# EasyEDA Pro project STC-FOC-C2822.epro, board STC-FOC_V3
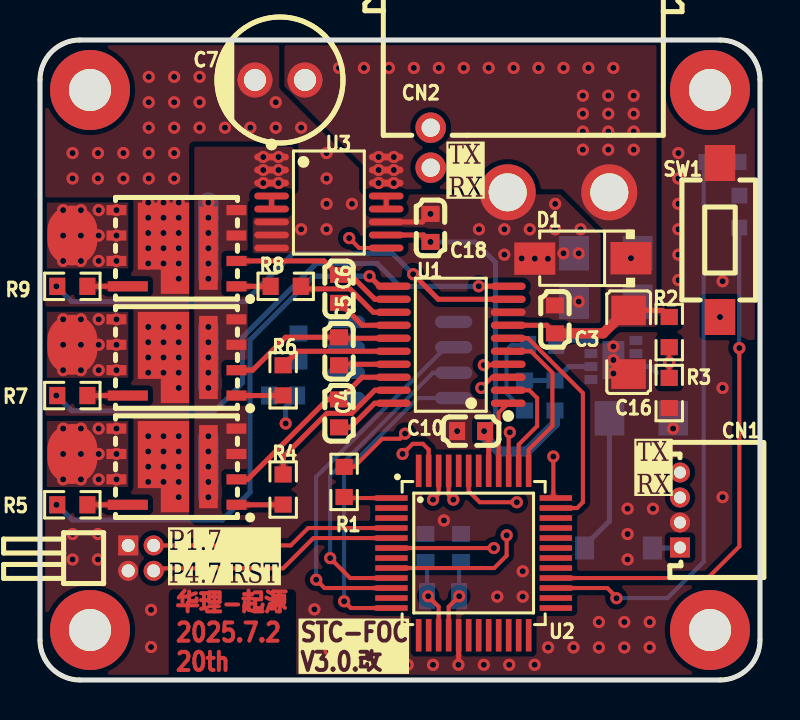
[diagram p7: board, top side]
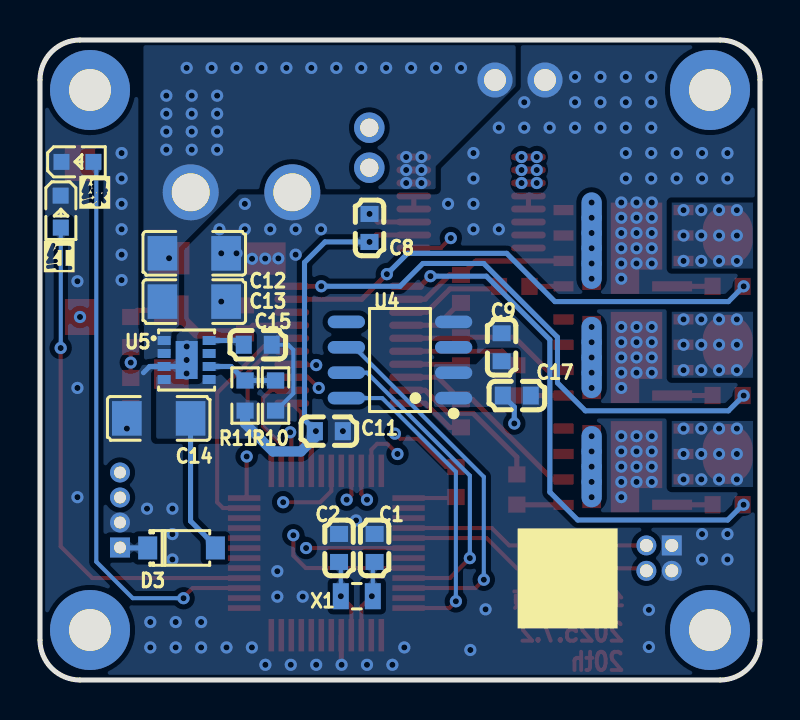
[diagram p8: board, bottom side, seen from below]

Outline 36 x 32 mm; copper layers: Top Layer, Inner1, Inner2, Bottom Layer. Coordinates in mm from the lower left corner of the outline.
Outline path: 0,30 0,2 arc(0.59,0.59) 2,0 34,0 arc(35.41,0.59) 36,2 36,30 arc(35.41,31.41) 34,32 2,32 arc(0.59,31.41) 0,30
Stack: Top Layer 0.035mm 外层铜厚1oz / Dielectric1 0.2104mm 7628 RC49% 8.6mil / Inner1 0.0152mm 内层铜厚 / Dielectric2 1.065mm 1.1mm H/HOZ 含铜 / Inner2 0.0152mm 内层铜厚 / Dielectric3 0.2104mm 7628 RC49% 8.6mil / Bottom Layer 0.035mm 外层铜厚1oz

## Design rules (mm)
net D-: UART1
net D+: UART1
net RX2: UART2
net TX2: UART2
template: xyf_v1.1
spacing copperThickness1oz (default): track to track 0.102, other pairs 0.152 to 0.3
spacing copperThickness2oz: track to track 0.203, other pairs 0.152 to 0.3
spacing 0焊盘板框间距: track to track 0.152, other pairs 0 to 0.3
spacing copperThicknessInner0.5oz: track to track 0.089, other pairs 0.152 to 0.3
track width copperThickness1oz (default): min 0.127, default 0.254, max 2.54
track width copperThickness2oz: min 0.203, default 0.254, max 2.54
track width copperThickness0.5oz: min 0.089, default 0.254, max 2.54
differential pair differentialPair (default): width min 0.127, default 0.254, max 2.54; gap min 0.152, default 0.152
via viaSize (default): diameter min 0.5, default 0.61, max 10; hole min 0.3, default 0.305, max 6.3
via viaSize2: diameter min 0.5, default 0.61, max 10; hole min 0.3, default 0.305, max 6.299
via viaSize4: diameter min 0.45, default 0.61, max 10; hole min 0.3, default 0.305, max 6.299

## Placement (name value [footprint] x y rotation side)
C1  15pF  [C0603]  19.27 6.6 270 bottom
C2  15pF  [C0603]  21.05 6.6 270 bottom
C3  100nF  [C0603]  25.75 18.03 270 top
C4  1uF  [C0603]  14.95 13.33 270 top
C5  1uF  [C0603]  14.95 16.44 270 top
C6  1uF  [C0603]  14.95 19.56 270 top
C7  470uF  [CAP-TH_BD6.3-P2.50-D0.6-FD-1]  12 30 180 top
C8  22uF  [C0603]  19.52 22.6 270 bottom
C9  100nF  [C0603]  12.92 16.64 270 bottom
C10  100nF  [C0603]  21.56 12.44 0 top
C11  22uF  [C0603]  21.56 12.44 0 bottom
C12  22uF  [C1206]  28.29 21.33 0 bottom
C13  22uF  [C1206]  28.29 18.92 0 bottom
C14  22uF  [C1206]  30.06 13.08 180 bottom
C15  430pF  [C0603]  25.11 16.76 180 bottom
C16  22uF  [C1206]  29.43 16.89 90 top
C17  22uF  [C0603]  12.16 14.22 0 bottom
C18  100nF  [C0603]  19.52 22.6 90 top
CN1  HC-1.25-4AW  [CONN-TH_4P-P1.25_HCTL_HC-1.25-4AW]  32 8.5 90 top
CN2  XT30PW(2+2)-M.G.B  [CONN-TH_4P-XT30PW-M]  24 26 180 top
D1  SMAJ15A  [SMA_L4.3-W2.6-LS5.0-RD]  27.14 21.08 180 top
D3  B5819W  [SOD-123_L2.8-W1.8-LS3.7-RD]  28.92 6.6 180 bottom
GLED1  NCD0603C1  [LED0603-RD]  34.13 25.91 180 bottom
H1  1271WR-2x2P  [CONN-TH_1271WR-2X2P]  5.05 6.09 270 top
NOREF  -  [Pad_e41]  1.62 22.22 0 top
NOREF#2  -  [Pad_e38]  1.62 11.3 0 top
NOREF#3  -  [Pad_e23]  1.62 16.76 0 top
Q1  SIZF906BDT-T1-GE3  [PQFN-8_L6.0-W5.0-P1.27-BL-EP_ONSEMI_483AT]  6.82 10.67 90 top
Q2  SIZF906BDT-T1-GE3  [PQFN-8_L6.0-W5.0-P1.27-BL-EP_ONSEMI_483AT]  6.82 16.13 90 top
Q3  SIZF906BDT-T1-GE3  [PQFN-8_L6.0-W5.0-P1.27-BL-EP_ONSEMI_483AT]  6.82 21.59 90 top
QR1  -  [JLC-QRCODE-5x5]  9.62 5.08 180 bottom
R1  300Ω  [R0603]  15.21 9.9 90 top
R2  47kΩ  [R0603]  31.46 17.4 90 top
R3  10kΩ  [R0603]  31.46 14.35 90 top
R4  5.6Ω  [R0603]  12.16 9.52 270 top
R5  5.6Ω  [R0603]  1.62 8.76 0 top
R6  5.6Ω  [R0603]  12.16 14.98 270 top
R7  5.6Ω  [R0603]  1.62 14.22 0 top
R8  5.6Ω  [R0603]  12.28 19.68 180 top
R9  5.6Ω  [R0603]  1.62 19.68 0 top
R10  100kΩ  [R0603]  24.22 14.22 270 bottom
R11  309kΩ  [R0603]  25.75 14.22 90 bottom
RLED1  NCD0603R1  [LED0603-RD_RED]  34.96 23.42 270 bottom
SCREW1  -  [M2螺丝]  2.5 29.5 0 top
SCREW2  -  [M2螺丝]  33.5 29.5 0 top
SCREW3  -  [M2螺丝]  2.5 2.5 0 top
SCREW4  -  [M2螺丝]  33.5 2.5 0 top
SW1  TS3625A  [KEY-SMD_L6.0-W3.5-LS8.4]  34 22 90 top
U1  DRV8300DPWR  [TSSOP-20_L6.5-W4.4-P0.65-LS6.4-BL]  20.54 16.76 90 top
U2  AI8051U-34K64-QFP48  [LQFP-48_L7.0-W7.0-P0.50-LS9.0-BL_1]  21.68 6.35 270 top
U3  INA250A2PWR  [TSSOP-16_L5.0-W4.4-P0.65-LS6.4-BL]  14.44 23.87 270 top
U4  MT6701CT-STD  [SOP-8_L4.9-W3.9-P1.27-LS6.0-BL]  18 16 90 bottom
U5  TPS82130SILR  [USIP-8_L3.0-W2.8-P0.65-TL-EP]  28.67 16 180 bottom
X1  32.768kHz  [CRYSTAL-SMD_2P-L2.0-W1.2]  20.16 4.19 180 bottom

## Footprints (pads in the part's own frame, mm; a bottom-side part is the same pattern mirrored in y, then rotated)
C0603
  rect 0.8x0.9 smd: 1(-0.7,0) 2(0.7,0)
C1206
  rect 1.485x1.728 smd: 1(-1.593,0) 2(1.593,0)
CAP-TH_BD6.3-P2.50-D0.6-FD-1
  round 1.75 hole 1.1: 1(-1.25,0) 2(1.25,0)
CONN-TH_4P-P1.25_HCTL_HC-1.25-4AW
  rect 1x1 hole 0.6: 1(-1.875,0)
  round 1 hole 0.6: 2(-0.625,0) 3(0.625,0) 4(1.875,0)
CONN-TH_4P-XT30PW-M
  round 2.8 hole 1.9: 1(-4.465,1.615) 2(0.615,1.615)
  round 1.524 hole 0.914: 3(4.465,0.385) 4(4.465,-1.615)
CONN-TH_1271WR-2X2P
  rect 1x1 hole 0.65: 1(-0.635,-0.635)
  round 1 hole 0.65: 2(-0.635,0.635) 3(0.635,-0.635) 4(0.635,0.635)
CRYSTAL-SMD_2P-L2.0-W1.2
  rect 0.8x1.3 smd: 1(-0.8,0) 2(0.8,0)
KEY-SMD_L6.0-W3.5-LS8.4
  rect 1.8x1.524 smd: 1(-3.85,0) 2(3.85,0)
LED0603-RD
  rect 0.8x0.8 smd: 1(-0.799,0) 2(0.799,0)
LED0603-RD_RED
  rect 0.8x0.8 smd: 1(-0.799,-0.004) 2(0.799,0.004)
LQFP-48_L7.0-W7.0-P0.50-LS9.0-BL_1
  rect 0.28x1.62 smd: 1(-2.75,-4.11) 2(-2.25,-4.11) 3(-1.75,-4.11) 4(-1.25,-4.11) 5(-0.75,-4.11) 6(-0.25,-4.11) 7(0.25,-4.11) 8(0.75,-4.11) 9(1.25,-4.11) 10(1.75,-4.11) 11(2.25,-4.11) 12(2.75,-4.11) 25(2.75,4.11) 26(2.25,4.11) 27(1.75,4.11) 28(1.25,4.11) 29(0.75,4.11) 30(0.25,4.11) 31(-0.25,4.11) 32(-0.75,4.11) 33(-1.25,4.11) 34(-1.75,4.11) 35(-2.25,4.11) 36(-2.75,4.11)
  rect 1.62x0.28 smd: 13(4.11,-2.75) 14(4.11,-2.25) 15(4.11,-1.75) 16(4.11,-1.25) 17(4.11,-0.75) 18(4.11,-0.25) 19(4.11,0.25) 20(4.11,0.75) 21(4.11,1.25) 22(4.11,1.75) 23(4.11,2.25) 24(4.11,2.75) 37(-4.11,2.75) 38(-4.11,2.25) 39(-4.11,1.75) 40(-4.11,1.25) 41(-4.11,0.75) 42(-4.11,0.25) 43(-4.11,-0.25) 44(-4.11,-0.75) 45(-4.11,-1.25) 46(-4.11,-1.75) 47(-4.11,-2.25) 48(-4.11,-2.75)
M2螺丝
  round 4 hole 2.1: 1(0,0)
Pad_e23
  oval 2.5x3 smd: 1(0,0)
Pad_e38
  oval 2.5x3 smd: 1(0,0)
Pad_e41
  oval 2.5x3 smd: 1(0,0)
PQFN-8_L6.0-W5.0-P1.27-BL-EP_ONSEMI_483AT
  rect 0.51x1 smd: 1(-1.905,-3) 2(-0.635,-3) 3(0.635,-3) 4(1.905,-3) 5(1.905,3) 6(0.635,3) 7(-0.635,3)
  rect 0.51x2 smd: 8(-1.905,2.43)
  custom 4.56x2.57 smd: 9(0,0.65)
  rect 4.16x0.93 smd: 10(0,-1.595)
R0603
  rect 0.806x0.864 smd: 1(-0.753,0) 2(0.753,0)
SMA_L4.3-W2.6-LS5.0-RD
  rect 2.046x1.62 smd: 1(-2.404,-0.009) 2(2.404,0.009)
SOD-123_L2.8-W1.8-LS3.7-RD
  rect 0.95x1.15 smd: 1(-1.692,0) 2(1.692,0)
SOP-8_L4.9-W3.9-P1.27-LS6.0-BL
  oval 0.63x1.865 smd: 1(-1.905,-2.683) 2(-0.635,-2.683) 3(0.635,-2.683) 4(1.905,-2.683) 5(1.905,2.683) 6(0.635,2.683) 7(-0.635,2.683) 8(-1.905,2.683)
TSSOP-16_L5.0-W4.4-P0.65-LS6.4-BL
  oval 0.343x1.732 smd: 1(-2.275,-2.866) 2(-1.625,-2.866) 3(-0.975,-2.866) 4(-0.325,-2.866) 5(0.325,-2.866) 6(0.975,-2.866) 7(1.625,-2.866) 8(2.275,-2.866) 9(2.275,2.866) 10(1.625,2.866) 11(0.975,2.866) 12(0.325,2.866) 13(-0.325,2.866) 14(-0.975,2.866) 15(-1.625,2.866) 16(-2.275,2.866)
TSSOP-20_L6.5-W4.4-P0.65-LS6.4-BL
  oval 0.364x1.742 smd: 1(-2.925,-2.871) 2(-2.275,-2.871) 3(-1.625,-2.871) 4(-0.975,-2.871) 5(-0.325,-2.871) 6(0.325,-2.871) 7(0.975,-2.871) 8(1.625,-2.871) 9(2.275,-2.871) 10(2.925,-2.871) 11(2.925,2.871) 12(2.275,2.871) 13(1.625,2.871) 14(0.975,2.871) 15(0.325,2.871) 16(-0.325,2.871) 17(-0.975,2.871) 18(-1.625,2.871) 19(-2.275,2.871) 20(-2.925,2.871)
USIP-8_L3.0-W2.8-P0.65-TL-EP
  rect 0.65x0.45 smd: 1(-1.125,0.975) 2(-1.125,0.325) 3(-1.125,-0.325) 4(-1.125,-0.975) 5(1.125,-0.975) 6(1.125,-0.325) 7(1.125,0.325) 8(1.125,0.975)
  rect 1.1x1.9 smd: 9(0,0)

## Nets
As in the schematic, except:
OUT_A: NOREF#2.1 Q1.5 Q1.6 Q1.7
OUT_B: NOREF#3.1 Q2.5 Q2.6 Q2.7
OUT_C: NOREF.1 Q3.5 Q3.6 Q3.7

Pads without a net: SCREW1 1; SCREW2 1; SCREW3 1; SCREW4 1; U2 2 3 7 11 13 14 18 19 20 21 22 23 24 25 26 29 30 31 32 33 34 42 44 48; U4 3 5; U5 7

## Via types
v1: diameter 0.61, hole 0.305, Top Layer to Bottom Layer, 252 vias

## Routing (per net, layer and track width the routed paths; a pad name or vN(x,y) marks a point on that pad's centre or on a via; arc(x,y) is an arc through that point)
3V3: length 42.5
  Top Layer w0.254: C10.2 22.43,12.27 U2.41 ; U3.10 19.18,22.25 v1(19.52,21.9)
  Inner2 w0.254: v1(12.28,12.83) 14.7,10.41 20.17,10.41 v1(22.21,12.44)
  Bottom Layer w0.254: D3.2 27.23,6.7 28.47,7.94 C14.2 ; v1(22.21,12.44) 22.78,13.01 22.78,20.88 21.75,21.9 v1(19.52,21.9) ; C17.2 12.28,13.65 v1(12.28,12.83)
  Bottom Layer w0.508: v1(22.21,12.44) 22.21,12.17 22.95,11.43 24.35,11.43 25.75,12.83 R11.1
+9V: length 8.8
  Top Layer w0.254: C16.2 31.13,18.48 R2.2 ; C3.2 25.34,17.74 U1.7
  Top Layer w0.508: C3.2 28.16,17.33 29.31,18.48 C16.2
  vias: v1(14.95,30.61) v1(16.2,30.61) v1(16.93,26.15) v1(16.93,25.5) v1(16.93,24.85) v1(17.45,30.61) v1(17.69,26.15) v1(17.69,25.5) v1(17.69,24.85) v1(18.69,30.61) v1(19.94,30.61) v1(21.19,30.61) v1(22.43,30.61) v1(23.68,30.61) v1(24.93,30.61) v1(26.17,30.61) v1(27.14,29.22) v1(27.14,28.31) v1(27.14,27.42) v1(27.14,26.52) v1(27.42,30.61) v1(28.41,29.22) v1(28.41,28.31) v1(28.41,27.42) v1(28.41,26.52) v1(28.67,30.61) v1(29.55,21.09) v1(29.68,29.22) v1(29.68,28.31) v1(29.68,27.42) v1(29.68,26.52)
GND: length 10.9
  Top Layer w0.254: v1(19.52,23.3) 19.12,22.9 U3.11 ; U2.17 20.93,0.77 v1(20.92,0.76)
  Bottom Layer w0.203: R10.2 24.19,13.47 23.33,14.33 23.33,16.51 23.59,16.76 C15.2
  Bottom Layer w0.254: v1(28.67,16) 28.99,15.67 U5.3 30.52,15.67 30.83,15.36
  vias: v1(1.63,26.35) v1(1.63,25.08) v1(1.63,7.3) v1(1.63,6.03) v1(2.9,26.35) v1(2.9,25.08) v1(2.9,7.3) v1(2.9,6.03) v1(4.17,26.35) v1(4.17,25.08) v1(5.44,30.16) v1(5.44,28.89) v1(5.44,27.62) v1(5.44,26.35) v1(5.44,25.08) v1(5.41,23.87) v1(5.41,23.11) v1(5.41,22.35) v1(5.41,21.59) v1(5.41,20.83) v1(5.41,17.65) v1(5.41,16.89) v1(5.41,16.13) v1(5.41,15.36) v1(5.41,12.19) v1(5.41,11.43) v1(5.41,10.67) v1(5.41,9.9) v1(5.55,3.51) v1(5.55,1.65) v1(6.17,23.87) v1(6.17,23.11) v1(6.17,22.35) v1(6.17,21.59) v1(6.17,20.83) v1(6.17,17.65) v1(6.17,16.89) v1(6.17,16.13) v1(6.17,15.36) v1(6.17,12.19) v1(6.17,11.43) v1(6.17,10.67) v1(6.17,9.9) v1(6.71,30.16) v1(6.71,28.89) v1(6.71,27.62) v1(6.71,26.35) v1(6.71,25.08) v1(6.94,23.87) v1(6.94,23.11) v1(6.94,22.35) v1(6.94,21.59) v1(6.94,20.83) v1(6.94,20.06) v1(6.94,17.65) v1(6.94,16.89) v1(6.94,16.13) v1(6.94,15.36) v1(6.94,14.6) v1(6.94,12.19) v1(6.94,11.43) v1(6.94,10.67) v1(6.94,9.9) v1(6.94,9.14) v1(7.98,30.16) v1(7.98,28.89) v1(7.98,27.62) v1(9.25,30.16) v1(9.25,28.89) v1(9.25,27.62) v1(10.52,27.62) v1(11.79,28.89) v1(11.79,27.62) v1(13.06,27.62) v1(13.06,22.54) v1(13.72,3.53) v1(14.33,26.35) v1(14.33,25.08) v1(14.33,23.81) v1(14.33,22.54) v1(14.48,1.5) v1(15.6,23.81) v1(17.78,1.63) v1(18.38,0.76) v1(19.65,0.76) v1(20.2,7.98) v1(20.86,12.44) v1(21.95,22.54) v1(22.19,0.76) v1(22.87,4.17) v1(23.22,22.54) v1(23.22,21.27) v1(23.46,0.76) v1(24.08,21.08) v1(24.13,5.44) v1(24.13,4.17) v1(24.49,22.54) v1(24.74,21.07) v1(24.73,0.76) v1(25.4,21.06) v1(25.41,1.63) v1(25.76,23.81) v1(25.76,22.54) v1(26.18,21.33) v1(26.68,1.63) v1(26.94,21.33) v1(26.94,18.92) v1(27.03,22.54) v1(27.94,2.9) v1(27.94,1.63) v1(28.67,16.67) v1(28.67,15.33) v1(29.22,2.9) v1(29.22,1.63) v1(29.38,8.57) v1(29.38,7.3) v1(29.38,6.03) v1(30.49,2.9) v1(30.49,1.63) v1(30.65,8.57) v1(31.66,12.57) v1(31.92,26.35) v1(31.92,25.08) v1(31.92,23.81) v1(31.92,22.54) v1(31.92,21.27) v1(31.92,20) v1(34.13,19.94) v1(34.13,14.6) v1(34.13,9.14)
PVCC: length 9.9
  Bottom Layer w1.016: v1(8.42,14.6) v1(8.42,15.36) v1(8.42,16.13) v1(8.42,16.89) v1(8.42,17.65) ; v1(8.42,12.19) v1(8.42,11.43) v1(8.42,10.67) v1(8.42,9.9) v1(8.42,9.14) ; v1(8.42,20.06) v1(8.42,20.83) v1(8.42,21.59) v1(8.42,22.35) v1(8.42,23.11) v1(8.42,23.87)
  vias: v1(11.16,26.15) v1(11.16,25.5) v1(11.16,24.85) v1(11.93,26.15) v1(11.93,25.5) v1(11.92,24.85)
ADC_I: length 17.7
  Top Layer w0.203: 17.31,21.6 15.96,21.6 v1(15.46,22.1) ; U2.47 19.43,11.52 19.14,11.81 18.63,11.81 v1(18.13,11.3)
  Inner2 w0.203: v1(15.46,22.1) 15.08,22.1 14.7,21.72 14.7,14.35 17.75,11.3 v1(18.13,11.3)
ADC_VCC: length 15.7
  Top Layer w0.203: U2.43 21.43,9.44 21.99,8.89 v1(23.84,8.89) ; R2.1 v1(31.46,15.87) R3.2
  Inner2 w0.203: v1(31.46,15.87) 31.21,15.87 24.22,8.89 v1(23.84,8.89)
CLK: length 15.9
  Top Layer w0.203: v1(14.51,6.09) 15.5,5.1 U2.9
  Bottom Layer w0.203: v1(14.51,6.09) 14.51,10.22 19.65,15.36 U4.7
CSN: length 16
  Top Layer w0.203: U2.12 15.54,3.6 v1(15.21,3.94)
  Bottom Layer w0.203: U4.8 18.89,14.09 15.21,10.41 v1(15.21,3.94)
D+: length 17.2
  Top Layer w0.203: v1(23.33,7.24) 23.33,6.22 22.71,5.6 U2.8
  Inner2 w0.203: v1(23.33,7.24) 26.73,10.63 31.75,10.63 CN1.4
D-: length 17.3
  Top Layer w0.203: U2.6 v1(22.69,6.6)
  Inner2 w0.203: v1(22.69,6.6) 23.48,6.6 26.03,9.14 26.79,9.14 arc(27.19,9.31) 27.36,9.71 arc(27.52,10.11) 27.92,10.27 28.31,10.27 arc(28.71,10.11) 28.88,9.71 arc(29.05,9.31) 29.45,9.14 29.84,9.14 arc(30.01,9.21) 30.08,9.38 arc(30.15,9.55) 30.32,9.62 31.36,9.62 arc(31.53,9.55) 31.6,9.38 arc(31.67,9.21) 31.84,9.14 31.99,9.14 32,9.13 CN1.3
GHA: length 7.8
  Top Layer w0.254: R4.1 12.16,11.15 14.34,13.33 15.59,13.33 16.74,14.49 U1.19
GHB: length 5.8
  Top Layer w0.254: U1.16 12.89,16.44 12.19,15.74 R6.1
GHC: length 5.2
  Top Layer w0.254: U1.13 16.67,18.39 15.5,19.56 13.17,19.56 R8.1
GLA: length 26.9
  Top Layer w0.254: U1.11 16.98,19.69 v1(16.48,20.19)
  Bottom Layer w0.254: 0.85,8.76 1.62,8 9.11,8 10.51,9.4 10.51,17.02 13.68,20.19 v1(16.48,20.19)
  vias: v1(0.82,8.76)
GLB: length 27.8
  Top Layer w0.254: U1.10 v1(21.94,19.69)
  Bottom Layer w0.254: v1(21.94,19.69) 18,19.69 16.86,20.83 13.81,20.83 10.13,17.14 10.13,14.86 8.73,13.46 1.58,13.46 v1(0.82,14.22)
GLC: length 24.9
  Top Layer w0.254: U1.9 19.91,19.04 v1(18.66,20.29)
  Bottom Layer w0.254: v1(0.82,19.68) 1.58,18.92 10.25,18.92 12.67,21.33 17.61,21.33 v1(18.66,20.29)
KEY: length 2.4
  Top Layer w0.203: R1.1 15.26,9.1 U2.1
LED_G: length 28.4
  Top Layer w0.203: U2.27 28.37,4.6 28.82,4.14 v1(28.82,4.09)
  Bottom Layer w0.203: v1(28.82,4.09) 31.36,4.09 33.19,5.91 33.19,25.76 GLED1.2
LED_R: length 25.8
  Top Layer w0.203: v1(34.97,16.6) 34.97,6.68 33.39,5.1 U2.28
  Bottom Layer w0.203: RLED1.2 34.96,16.61 v1(34.97,16.6)
MISO: length 18.6
  Top Layer w0.203: U2.10 14.23,4.6 v1(13.81,5.01)
  Bottom Layer w0.203: U4.6 20.29,16.64 13.81,10.16 13.81,5.08
OUT_A:
  vias: v1(1.16,12.57) v1(1.16,11.3) v1(1.16,10.03) v1(2.05,12.57) v1(2.05,11.3) v1(2.05,10.03) v1(2.94,12.57) v1(2.94,11.3) v1(2.94,10.03) v1(3.82,12.57) v1(3.82,11.3) v1(3.82,10.03)
OUT_B:
  vias: v1(1.16,18.03) v1(1.16,16.76) v1(1.16,15.49) v1(2.05,18.03) v1(2.05,16.76) v1(2.05,15.49) v1(2.94,18.03) v1(2.94,16.76) v1(2.94,15.49) v1(3.82,18.03) v1(3.82,16.76) v1(3.82,15.49)
OUT_C:
  vias: v1(1.16,23.49) v1(1.16,22.22) v1(1.16,20.95) v1(2.05,23.49) v1(2.05,22.22) v1(2.05,20.95) v1(2.94,23.49) v1(2.94,22.22) v1(2.94,20.95) v1(3.82,23.49) v1(3.82,22.22) v1(3.82,20.95)
P1.7: length 12.3
  Top Layer w0.203: H1.2 12.54,6.73 13.41,7.6 U2.4
P4.7: length 12.6
  Top Layer w0.203: U2.5 13.67,7.1 12.16,5.59 5.81,5.59 5.68,5.46
PWM1N: length 7.1
  Top Layer w0.203: U1.4 23.37,15.75 v1(22.19,15.75) ; v1(23.49,12.39) 23.43,12.33 U2.39
  Inner2 w0.203: v1(22.19,15.75) 23.49,14.45 v1(23.49,12.39)
PWM1P: length 3.6
  Top Layer w0.203: U2.40 22.93,13.36 U1.1
PWM2N: length 8.1
  Top Layer w0.203: U2.37 24.43,11.51 25.62,12.7 25.62,15.36 24.55,16.44 U1.5
PWM2P: length 5.6
  Top Layer w0.203: U2.38 23.93,11.77 24.86,12.7 24.86,14.09 24.47,14.49 U1.2
PWM3N: length 11.8
  Top Layer w0.203: U1.6 24.41,17.09 27.14,14.35 27.14,8.89 26.85,8.6 U2.35
PWM3P: length 9.7
  Top Layer w0.203: v1(22.06,14.6) 22.6,15.14 U1.3 ; U2.36 25.67,9.22 v1(25.67,11.17)
  Inner2 w0.203: v1(25.67,11.17) 25.28,11.56 23.46,11.56 22.83,12.19 22.83,13.84 v1(22.06,14.6)
RX2: length 21.1
  Top Layer w0.203: U2.45 20.43,9.25 v1(20.67,9.02)
  Inner1 w0.203: v1(20.67,9.02) 21.56,9.9 21.56,13.97 20.92,14.6 20.92,15.63 20.23,16.31 20.23,17.15 20.92,17.84 20.92,18.67 20.23,19.36 20.23,20.2 20.92,20.89 20.92,21.72 20.23,22.41 20.23,23.25 20.92,23.93 20.92,24.23 CN2.3
SHA: length 10
  Top Layer w0.254: U1.18 16.11,15.14 15,14.03 C4.1 14.38,14.03 10.38,10.03 9.82,10.03
SHB: length 8.5
  Top Layer w0.254: U1.15 15,17.09 C5.1 12.28,17.14 10.63,15.49 Q2.2
SHC: length 8.6
  Top Layer w0.254: Q3.2 14.21,20.95 14.9,20.26 C6.1 15.52,20.26 16.74,19.04 U1.12
TX2: length 21
  Top Layer w0.203: U2.46 19.93,9.3 v1(19.65,9.02)
  Inner1 w0.203: CN2.4 18.52,26.6 18.52,21.7 19.65,20.57 v1(19.65,9.02)
$1N7270: length 3.9
  Top Layer w0.203: U2.16 20.43,3.66 v1(20.96,4.19)
  Bottom Layer w0.203: C2.2 20.96,5.81 v1(20.96,4.19)
$1N7283: length 3.9
  Top Layer w0.203: v1(19.41,4.19) 19.93,3.67 U2.15
  Bottom Layer w0.203: 19.36,4.19 19.36,5.81 C1.2
$1N55931: length 22.2
  Top Layer w0.203: R1.2 15.71,10.66 17.11,12.06 18,12.06 v1(18.25,12.32)
  Inner2 w0.203: v1(18.25,12.32) 18.25,12.83 23.58,18.15 v1(34,18.15)
$1N57228: length 1.8
  Bottom Layer w0.254: C15.1 26.03,16.97 U5.8
$1N57378: length 3.6
  Bottom Layer w0.254: R10.1 R11.2 26.45,15.67 U5.6
$1N58049: length 3.2
  Top Layer w0.254: C4.2 15.53,12.63 16.73,13.84 U1.20
$1N58059: length 2.7
  Top Layer w0.254: C5.2 15,15.79 U1.17
$1N58070: length 3.2
  Top Layer w0.254: U1.14 16.12,17.74 15,18.86 C6.2
$1N58474: length 2.3
  Top Layer w0.254: Q1.1 12.15,8.76 R4.2
$1N58515: length 2
  Top Layer w0.254: Q1.8 R5.2
$1N58820: length 2.3
  Top Layer w0.254: Q2.1 12.15,14.22 R6.2
$1N58822: length 2
  Top Layer w0.254: Q2.8 R7.2
$1N59023: length 1.7
  Top Layer w0.254: Q3.1 R8.2
$1N59025: length 2
  Top Layer w0.254: Q3.8 R9.2
$1N74897: length 0.6
  Top Layer w0.254: U3.4 U3.5
$1N74901: length 0.6
  Top Layer w0.254: U3.13 U3.12
$1N76388: length 1.4
  Bottom Layer w0.254: D3.1 31.98,6.6 CN1.1

## Copper pours and planes (outline as drawn; the poured copper is in the pictures)
3V3 on Bottom Layer: 12.21,16.35 12.21,13.65 16.31,13.65 16.31,15.78 16.3,15.79 14.2,15.79 13.63,16.35
3V3 on Bottom Layer: 27.02,15.36 27.02,15.36 25.64,13.98 25.11,13.98 25.11,12.06 30.19,12.06 30.19,15.3 29.43,15.3 29.43,14.98 27.91,14.98 27.91,14.98 27.91,15.36
+9V on Top Layer: 12.22,32 12.22,29.69 16.22,25.69 16.22,24.54 26.13,24.54 28.29,22.38 28.29,17.65 30.83,17.65 30.83,32
+9V on Bottom Layer: 30.8,17.82 30.8,16.01 29.43,16.01 29.43,17.35 28.95,17.82
+9V on Bottom Layer: 12.22,32 12.22,29.69 16.22,25.69 16.22,24.54 26.13,24.54 29.05,21.62 29.05,17.65 30.83,17.65 30.83,32
+9V on Inner1: 12.28,31.62 30.83,31.62 30.83,22.86 12.28,22.86
+9V on Inner2: 16.22,30.39 18.38,30.39 18.38,24.51 16.22,24.51
+9V on Inner2: 12.28,31.62 30.83,31.62 30.83,22.86 12.28,22.86
GND on Top Layer: -1.3,34.42 37.81,34.42 37.81,-1.91 -1.3,-1.91
GND on Bottom Layer: -1.3,34.42 37.81,34.42 37.81,-1.91 -1.3,-1.91
GND on Inner1: -1.3,34.42 37.81,34.42 37.81,-1.91 -1.3,-1.91
GND on Inner2: -1.3,34.42 37.81,34.42 37.81,-1.91 -1.3,-1.91
PVCC on Top Layer: 12.67,26.67 12.67,24.55 11.06,24.55 10.38,23.87 10.38,8 7.84,8 7.71,8.13 7.71,26.67
PVCC on Inner1: 12.67,26.67 12.67,24.55 11.06,24.55 10.38,23.87 10.38,8 7.84,8 7.71,8.13 7.71,26.67
PVCC on Inner2: 12.67,26.67 12.67,24.55 11.06,24.55 10.38,23.87 10.38,8 7.84,8 7.71,8.13 7.71,26.67
OUT_A on Top Layer: 0.35,12.95 4.41,12.95 4.41,9.65 0.35,9.65
OUT_A on Bottom Layer: 0.35,12.95 4.41,12.95 4.41,9.65 0.35,9.65
OUT_A on Inner1: 0.35,12.95 4.41,12.95 4.41,9.65 0.35,9.65
OUT_A on Inner2: 0.35,12.95 4.41,12.95 4.41,9.65 0.35,9.65
OUT_B on Top Layer: 0.35,18.41 4.41,18.41 4.41,15.11 0.35,15.11
OUT_B on Bottom Layer: 0.35,18.41 4.41,18.41 4.41,15.11 0.35,15.11
OUT_B on Inner1: 0.35,18.41 4.41,18.41 4.41,15.11 0.35,15.11
OUT_B on Inner2: 0.35,18.41 4.41,18.41 4.41,15.11 0.35,15.11
OUT_C on Top Layer: 0.35,23.87 4.41,23.87 4.41,20.57 0.35,20.57
OUT_C on Bottom Layer: 0.35,23.87 4.41,23.87 4.41,20.57 0.35,20.57
OUT_C on Inner1: 0.35,23.87 4.41,23.87 4.41,20.57 0.35,20.57
OUT_C on Inner2: 0.35,23.87 4.41,23.87 4.41,20.57 0.35,20.57

Small or netless copper shapes (teardrops, artwork), in the pictures only: 118 on Top Layer, 46 on Bottom Layer, 4 on Inner1, 16 on Inner2

## Text on the board
Bottom Silkscreen Layer: 绿 | 红
Top Layer: 华理-起源 / 2025.7.2 / 20th
Top Silkscreen Layer: TX / RX | STC-FOC / V3.0.改 | P1.7 / P4.7 RST
